# EAGLE design OSHWA Certificate Test (EAGLE 7.7.0)
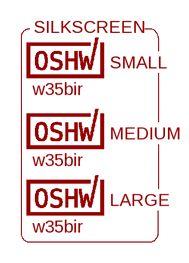
[diagram p0: schematic, sheet 1]

## Parts
U$1  w35bir  CERT-SMALL  [CERT-SMALL-SILK]
U$2  w35bir  CERT-MEDIUM  [CERT-MED-SILK]
U$3  w35bir  CERT-LARGE  [CERT-LARGE-SILK]

## Notes on the sheet
- SILKSCREEN
- SMALL
- MEDIUM
- LARGE

## Library data of the parts
U$1-U$3 = OSHW:CERT

## Board
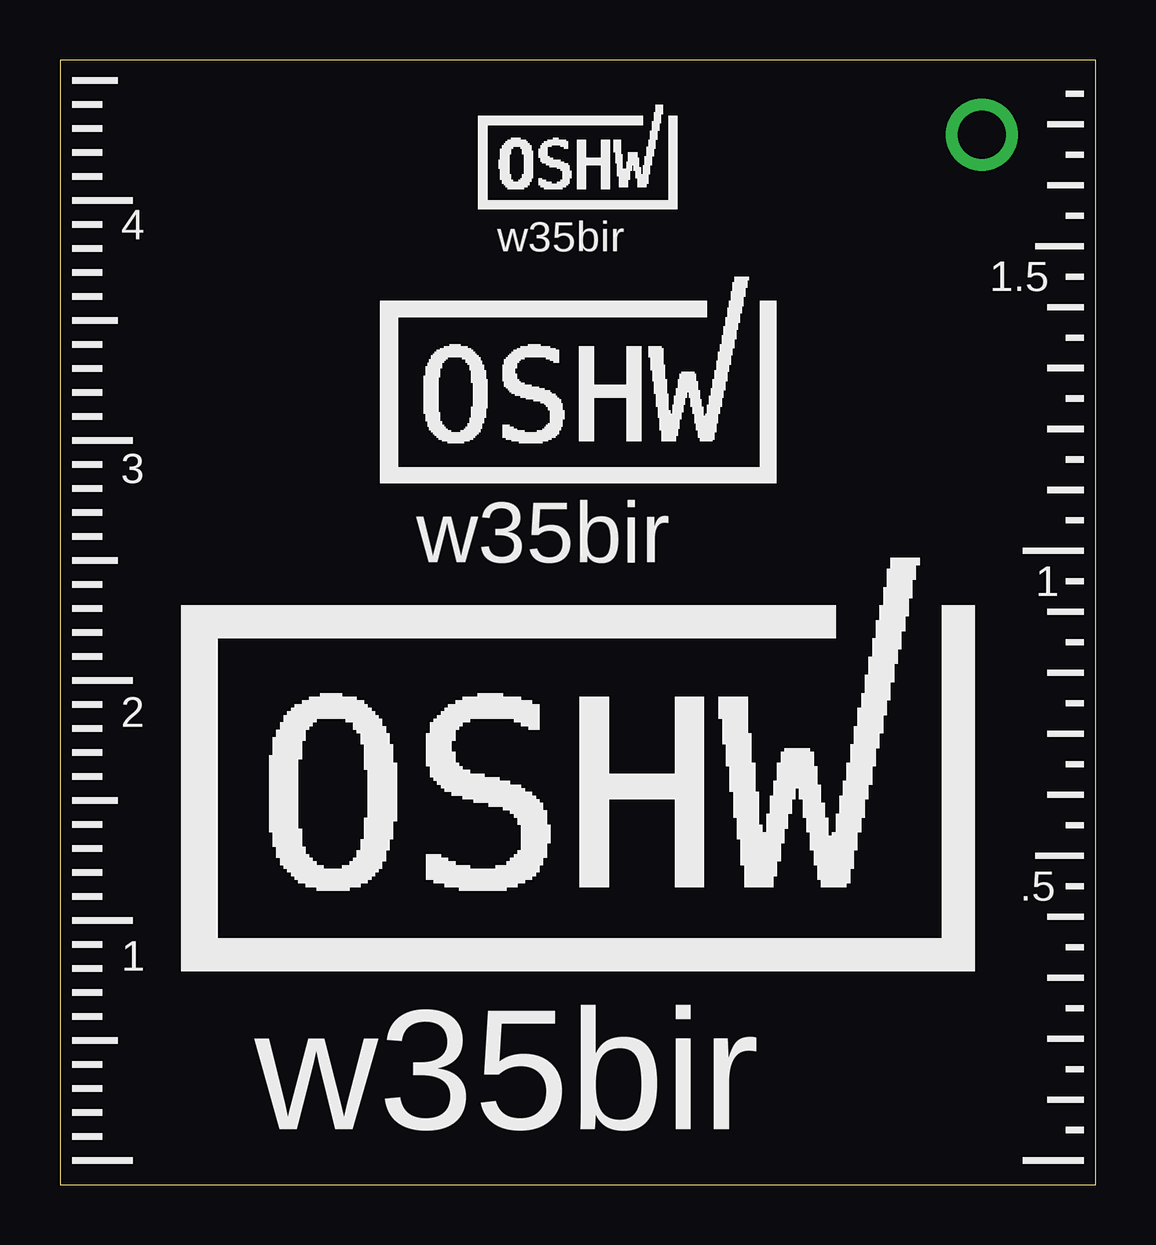
[diagram p1: board, top side]

Size 43.18 x 46.85 mm. Coordinates in mm from the lower left corner, seen from the top.
Outline: 0,0 43.18,0 43.18,46.85 0,46.85 0,0
Copper layers (1*16): Top 0.035mm / dielectric 1.5mm / Bottom 0.035mm
Design rules "default": minimum track width 10mil, minimum drill 24mil, track to track 8mil, track to pad 8mil, pad to pad 8mil, via to via 8mil, smd to smd 8mil, copper to edge 40mil, drill to drill 8mil, minimum pad ring 10mil, minimum via ring 8mil, stop-mask expansion 4mil, vias tented up to drill 0mil, thermal gap 10mil

### Placement (x,y rotation side)
U$1  21.59,40.64 0 top
U$2  21.59,29.21 0 top
U$3  21.59,8.89 0 top

### Tracks (layer width: path | path; a pad name or v marks a point on that pad's centre or on a via)
N$1  (via drill 2)
  other vias: 38.43,43.74

### Text on the board
tPlace: 4 | 1.5 | 3 | 1 | 2 | .5 | 1